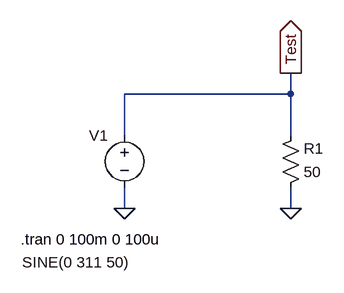
[diagram p0: schematic Draft1.asc]
Draft1.asc, the LTspice schematic file:
Version 4
SHEET 1 880 680
WIRE 288 80 288 48
WIRE 288 80 32 80
WIRE 32 144 32 80
WIRE 288 144 288 80
WIRE 32 256 32 224
WIRE 288 256 288 224
FLAG 32 256 0
FLAG 288 256 0
FLAG 288 48 Test
IOPIN 288 48 Out
SYMBOL res 272 240 M180
WINDOW 0 36 76 Left 2
WINDOW 3 36 40 Left 2
SYMATTR InstName R1
SYMATTR Value 50
SYMBOL voltage 32 128 R0
WINDOW 0 -55 16 Left 2
WINDOW 3 -158 211 Left 2
WINDOW 123 0 0 Left 0
WINDOW 39 0 0 Left 0
SYMATTR InstName V1
SYMATTR Value SINE(0 311 50)
TEXT -128 304 Left 2 !.tran 0 100m 0 100u

The netlist it stands for:
* Draft1.asc
R1 0 Test 50
V1 Test 0 SINE(0 311 50)
.tran 0 100m 0 100u
.backanno
.end